# EAGLE design rpi_ad7705 (EAGLE 8.1.0)
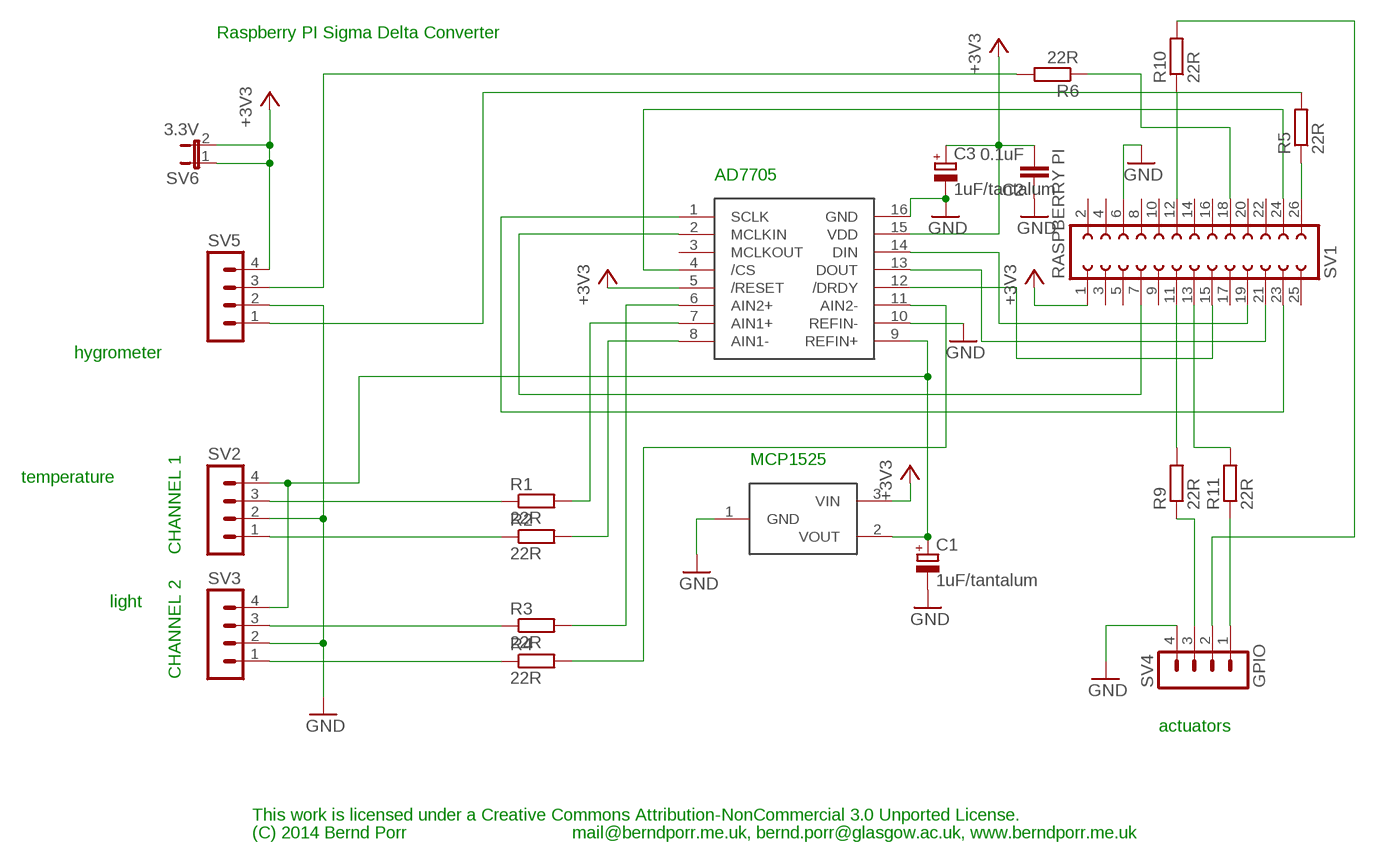
[diagram p0: schematic, sheet 1]

## Parts
C1  1uF/tantalum  CPOL-EUTT2D7  [TT2D7]
C2  0.1uF  C5/2.5  [C5B2.5]
C3  1uF/tantalum  CPOL-EUTT2D7  [TT2D7]
R1  22R  R-EU_0207/10  [0207/10]
R2  22R  R-EU_0207/10  [0207/10]
R3  22R  R-EU_0207/10  [0207/10]
R4  22R  R-EU_0207/10  [0207/10]
R5  22R  R-EU_0207/10  [0207/10]
R6  22R  R-EU_0207/10  [0207/10]
R9  22R  R-EU_0207/10  [0207/10]
R10  22R  R-EU_0207/10  [0207/10]
R11  22R  R-EU_0207/10  [0207/10]
SV1  RASPBERRY PI  FE13-2  [FE13-2]
SV2  MA04-1  [MA04-1]
SV3  MA04-1  [MA04-1]
SV4  GPIO  MA04-1  [MA04-1]
SV5  MA04-1  [MA04-1]
SV6  3.3V  JP1E  [JP1]
U$1  AD7705  [DIP16]
U$2  MCP1525  [TO92]

## Nets
+3V3: C2.2 C3.+ SV1.1 SV5.4 SV6.1 SV6.2 U$1.5(/RESET) U$1.15(VDD) U$2.3(VIN)
GND: C1.- C2.1 C3.- SV1.6 SV2.2 SV3.2 SV4.4 SV5.2 U$1.10(REFIN-) U$1.16(GND) U$2.1(GND)
N$1: SV1.19 U$1.14(DIN)
N$2: SV1.23 U$1.1(SCLK)
N$3: SV1.7 U$1.2(MCLKIN)
N$4: SV1.24 U$1.4(/CS)
N$5: C1.+ SV2.4 SV3.4 U$1.9(REFIN+) U$2.2(VOUT)
N$6: SV1.21 U$1.13(DOUT)
N$7: R2.2 U$1.8(AIN1-)
N$8: R1.2 U$1.7(AIN1+)
N$9: R3.2 U$1.6(AIN2+)
N$10: R4.2 U$1.11(AIN2-)
N$11: R1.1 SV2.3
N$12: R2.1 SV2.1
N$13: R3.1 SV3.3
N$14: R4.1 SV3.1
N$15: R9.2 SV1.11
N$16: R10.1 SV1.12
N$17: R11.2 SV1.13
N$18: R9.1 SV4.3
N$19: R11.1 SV4.1
N$20: R10.2 SV4.2
N$21: SV1.15 U$1.12(/DRDY)
N$22: R5.2 SV5.1
N$23: R5.1 SV1.26
N$24: R6.1 SV1.18
N$25: R6.2 SV5.3
Unconnected: SV1.2 SV1.3 SV1.4 SV1.5 SV1.8 SV1.9 SV1.10 SV1.14 SV1.16 SV1.17 SV1.20 SV1.22 SV1.25 U$1.3(MCLKOUT)

## Notes on the sheet
- Raspberry PI Sigma Delta Converter
- AD7705
- hygrometer
- MCP1525
- temperature
- CHANNEL 1
- light
- CHANNEL 2
- actuators
- This work is licensed under a Creative Commons Attribution-NonCommercial 3.0 Unported License.
- (C) 2014 Bernd Porr | mail@berndporr.me.uk, bernd.porr@glasgow.ac.uk, www.berndporr.me.uk

## Library data of the parts
C1 C3 = rcl:CPOL-EU: POLARIZED CAPACITOR, European symbol
C2 = capacitor-wima:C: CAPACITOR naming: grid - package width
R1-R6 R9-R11 = resistor:R-EU_: RESISTOR, European symbol
SV1 = con-lsta:FE13-2: FEMALE HEADER; OC_FARNELL: unknown; OC_NEWARK: unknown
SV2-SV5 = con-lstb:MA04-1: PIN HEADER; OC_FARNELL: unknown; OC_NEWARK: unknown
SV6 = jumper:JP1E: JUMPER
U$1 = rpi:AD7705
U$2 = rpi:MCP1525

## Board
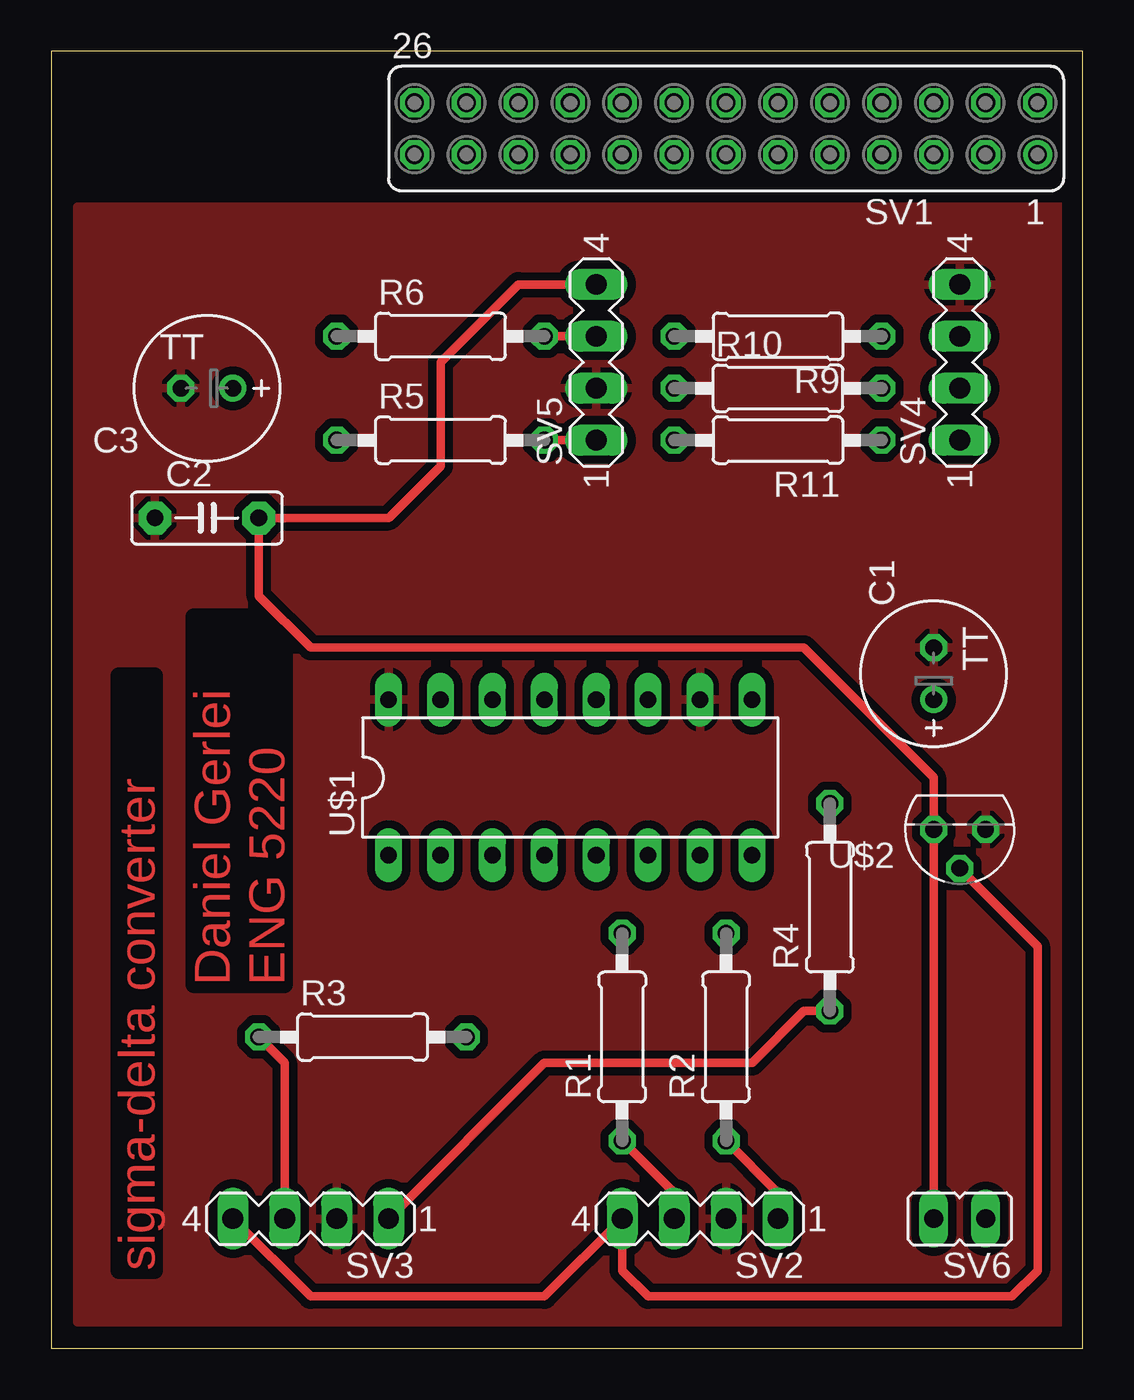
[diagram p1: board, top side]
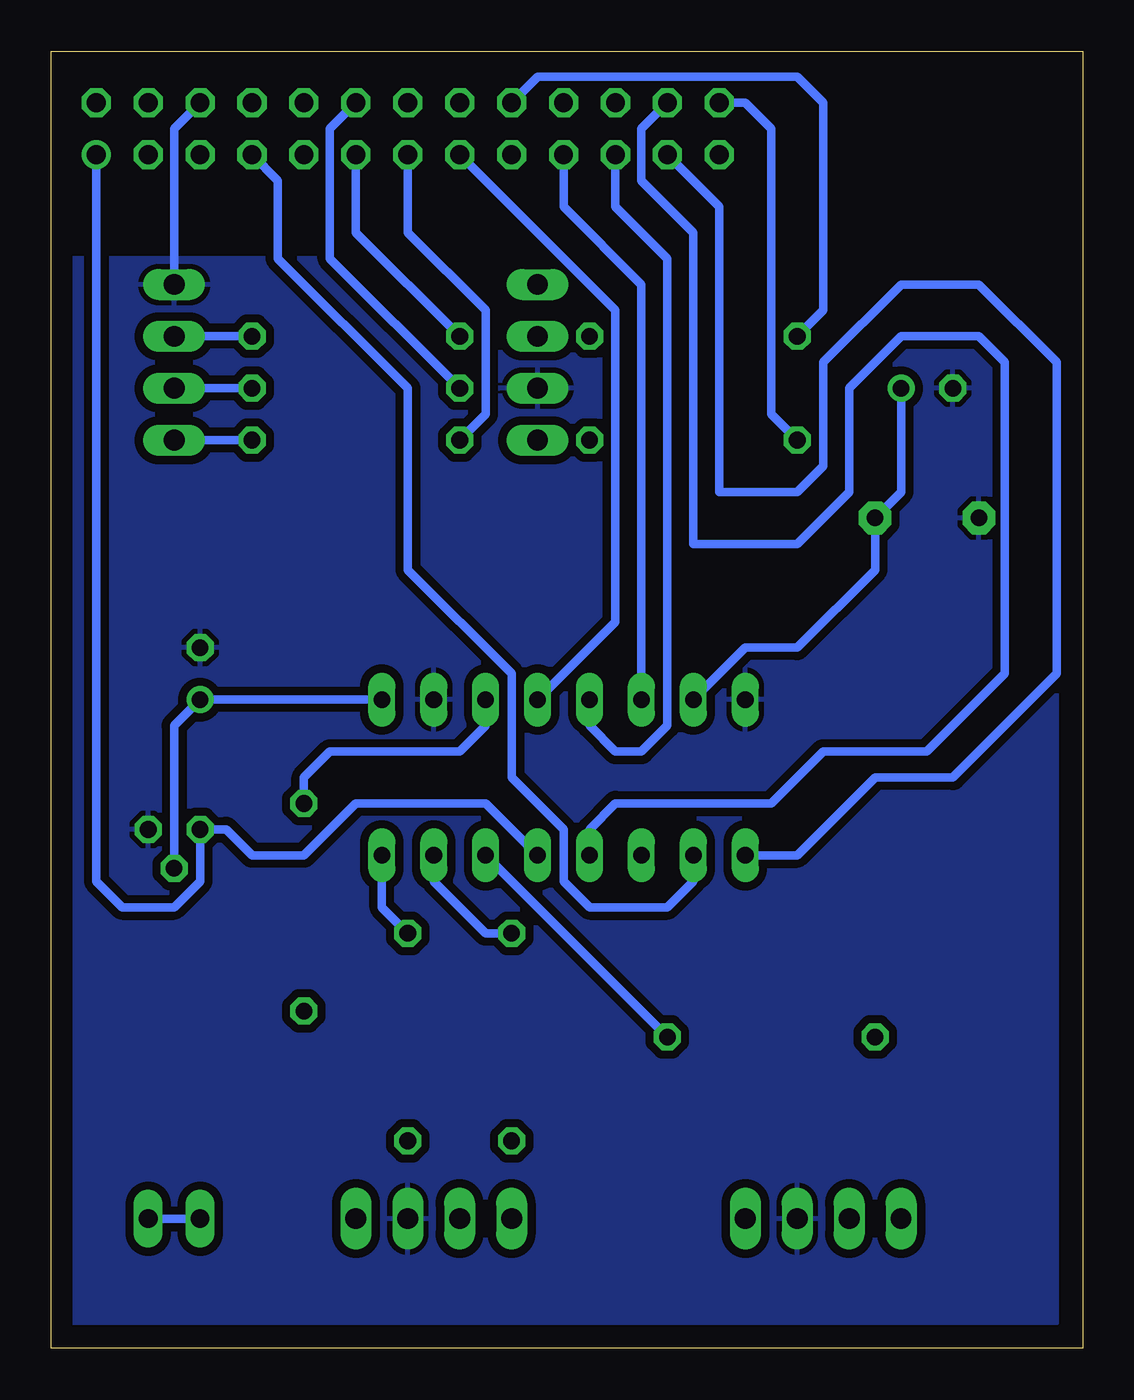
[diagram p2: board, bottom side, seen from below]

Size 50.47 x 63.49 mm. Coordinates in mm from the lower left corner, seen from the top.
Outline: 0,0 50.47,0 50.47,63.49 0,63.49 0,0
Copper layers (1*16): Top 0.035mm / dielectric 1.5mm / Bottom 0.035mm
Design rules "default": minimum track width 10mil, minimum drill 24mil, track to track 8mil, track to pad 8mil, pad to pad 8mil, via to via 8mil, smd to smd 8mil, copper to edge 40mil, drill to drill 8mil, minimum pad ring 10mil, minimum via ring 8mil, stop-mask expansion 4mil, vias tented up to drill 0mil, thermal gap 10mil

### Footprints (pad centres in the part's own frame; a part is rotated, then mirrored left to right if it is on the bottom)
TT2D7 = drill 0.813: + -1.27,0 | drill 0.813 octagon: - 1.27,0
C5B2.5 = drill 0.813 pad 1.6 octagon: 1 -2.54,0; 2 2.54,0
0207/10 = drill 0.813 octagon: 1 -5.08,0; 2 5.08,0
FE13-2 = drill 0.914: 1 -15.24,1.27 | drill 0.914 octagon: 2 -15.24,-1.27; 3 -12.7,1.27; 4 -12.7,-1.27; 5 -10.16,1.27; 6 -10.16,-1.27; 7 -7.62,1.27; 8 -7.62,-1.27; 9 -5.08,1.27; 10 -5.08,-1.27; 11 -2.54,1.27; 12 -2.54,-1.27; 13 0,1.27; 14 0,-1.27; 15 2.54,1.27; 16 2.54,-1.27; 17 5.08,1.27; 18 5.08,-1.27; 19 7.62,1.27; 20 7.62,-1.27; 21 10.16,1.27; 22 10.16,-1.27; 23 12.7,1.27; 24 12.7,-1.27; 25 15.24,1.27; 26 15.24,-1.27
MA04-1 = drill 1.016 long: 1 -3.81,0; 2 -1.27,0; 3 1.27,0; 4 3.81,0
JP1 = drill 0.914 long: 1 0,-1.27; 2 0,1.27
DIP16 = drill 0.813 long: 1 -8.89,-3.81; 2 -6.35,-3.81; 3 -3.81,-3.81; 4 -1.27,-3.81; 5 1.27,-3.81; 6 3.81,-3.81; 7 6.35,-3.81; 8 8.89,-3.81; 9 8.89,3.81; 10 6.35,3.81; 11 3.81,3.81; 12 1.27,3.81; 13 -1.27,3.81; 14 -3.81,3.81; 15 -6.35,3.81; 16 -8.89,3.81
TO92 = drill 0.813 octagon: 1 -3.81,0; 2 -2.54,1.905; 3 -1.27,0

### Placement (x,y rotation side)
C1  43.18,33.02 90 top
C2  7.62,40.64 0 top
C3  7.62,46.99 180 top
R1  27.94,15.24 90 top
R2  33.02,15.24 90 top
R3  15.24,15.24 0 top
R4  38.1,21.59 90 top
R5  19.05,44.45 0 top
R6  19.05,49.53 0 top
R9  35.56,49.53 180 top
R10  35.56,46.99 0 top
R11  35.56,44.45 180 top
SV1  33.02,59.69 180 top
SV2  31.75,6.35 180 top
SV3  12.7,6.35 180 top
SV4  44.45,48.26 90 top
SV5  26.67,48.26 90 top
SV6  44.45,6.35 90 top
U$1  25.4,27.94 0 top
U$2  41.91,25.4 180 top

### Tracks (layer width: path | path; a pad name or v marks a point on that pad's centre or on a via)
+3V3
  Top 0.406: SV6.2 U$2.3 43.18,27.94 36.83,34.29 12.7,34.29 10.16,36.83 C2.2 16.51,40.64 19.05,43.18 19.05,48.26 22.86,52.07 SV5.4
  Bottom 0.406: U$1.15 16.51,34.29 13.97,34.29 10.16,38.1 C2.2 8.89,41.91 C3.+ | U$1.5 29.21,26.67 35.56,26.67 38.1,24.13 40.64,24.13 41.91,25.4 U$2.3 43.18,22.86 44.45,21.59 46.99,21.59 48.26,22.86 SV1.1 | SV6.1 SV6.2
GND
  Bottom 0.406: SV1.6 44.45,59.69 SV4.4
  pour Bottom (isolate 0.406): 12.7,62.23 20.32,53.34 49.53,53.34 49.53,1.27 1.27,1.27 1.27,62.23
  pour Top (isolate 0.406): 1.27,55.88 49.53,55.88 49.53,1.27 1.27,1.27
N$1
  Bottom 0.406: SV1.19 25.4,55.88 21.59,52.07 U$1.14
N$2
  Bottom 0.406: U$1.1 13.97,24.13 10.16,27.94 6.35,27.94 1.27,33.02 1.27,48.26 5.08,52.07 8.89,52.07 12.7,48.26 12.7,43.18 13.97,41.91 17.78,41.91 17.78,55.88 SV1.23
N$3
  Bottom 0.406: SV1.7 39.37,57.15 39.37,53.34 33.02,46.99 33.02,38.1 27.94,33.02 27.94,27.94 25.4,25.4 25.4,22.86 24.13,21.59 20.32,21.59 19.05,22.86 U$1.2
N$4
  Bottom 0.406: U$1.4 24.13,25.4 22.86,26.67 15.24,26.67 12.7,29.21 7.62,29.21 3.81,33.02 3.81,48.26 5.08,49.53 8.89,49.53 11.43,46.99 11.43,41.91 13.97,39.37 19.05,39.37 19.05,54.61 21.59,57.15 21.59,59.69 SV1.24
N$5
  Top 0.406: U$2.2 48.26,19.68 48.26,3.81 46.99,2.54 29.21,2.54 27.94,3.81 SV2.4 24.13,2.54 12.7,2.54 SV3.4
  Bottom 0.406: U$1.9 C1.+ 44.45,30.48 U$2.2
N$6
  Bottom 0.406: SV1.21 22.86,55.88 20.32,53.34 20.32,30.48 21.59,29.21 22.86,29.21 24.13,30.48 U$1.13
N$7
  Bottom 0.406: R2.2 34.29,21.59 U$1.8
N$8
  Bottom 0.406: R1.2 29.21,20.32 31.75,22.86 U$1.7
N$9
  Bottom 0.406: R3.2 U$1.6
N$10
  Bottom 0.406: U$1.11 29.21,30.48 30.48,29.21 36.83,29.21 38.1,27.94 R4.2
N$11
  Top 0.406: SV2.3 30.48,7.62 R1.1
N$12
  Top 0.406: SV2.1 35.56,7.62 R2.1
N$13
  Top 0.406: R3.1 11.43,13.97 SV3.3
N$14
  Top 0.406: SV3.1 24.13,13.97 34.29,13.97 36.83,16.51 R4.1
N$15
  Bottom 0.406: R9.2 35.56,54.61 SV1.11
N$16
  Bottom 0.406: R10.1 36.83,53.34 36.83,59.69 SV1.12
N$17
  Bottom 0.406: R11.2 29.21,45.72 29.21,50.8 33.02,54.61 SV1.13
N$18
  Bottom 0.406: R9.1 SV4.3
N$19
  Bottom 0.406: R11.1 SV4.1
N$20
  Bottom 0.406: R10.2 SV4.2
N$21
  Bottom 0.406: U$1.12 22.86,35.56 22.86,50.8 SV1.15
N$22
  Top 0.406: R5.2 SV5.1
N$23
  Bottom 0.406: R5.1 15.24,45.72 15.24,59.69 16.51,60.96 SV1.26
N$24
  Bottom 0.406: R6.1 12.7,50.8 12.7,60.96 13.97,62.23 26.67,62.23 SV1.18
N$25
  Top 0.406: R6.2 SV5.3

### Text on the board
Top: Daniel Gerlei / ENG 5220 | sigma-delta converter